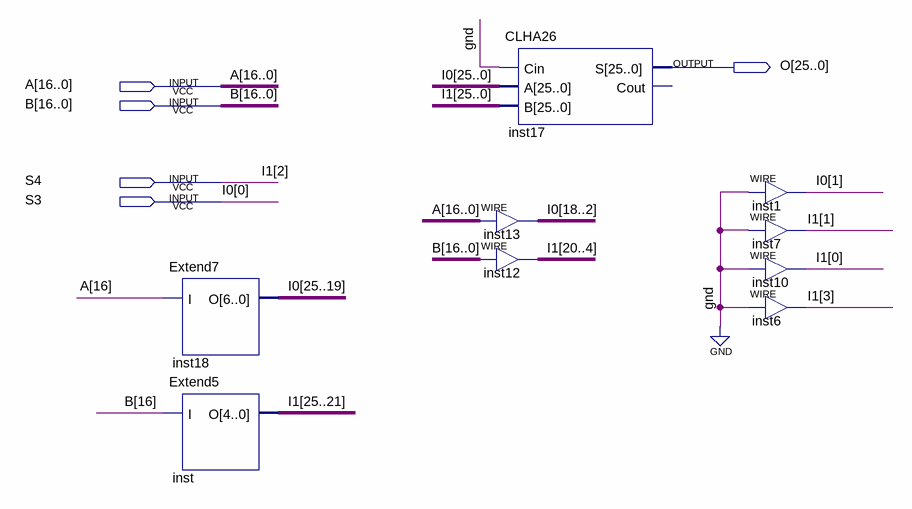
[diagram p0: schematic sheet]
// Quartus schematic R4R5.bdf as structural Verilog: 9 symbols, 5 pins
module R4R5 (
  input  [16:0] A,
  input  [16:0] B,
  input  S4,
  input  S3,
  output [25:0] O
);

  wire [25:0] I1;
  wire [25:1] I0;

  Extend7 inst18 (.I(A[16]), .O(I0[25:19]));
  Extend5 inst (.I(B[16]), .O(I1[25:21]));
  CLHA26 inst17 (.Cin(1'b0), .A({I0, S3}), .B({I1[25:3], S4, I1[1:0]}), .S(O));  // open: Cout
  assign I0[18:2] = A;  // WIRE inst13
  assign I1[20:4] = B;  // WIRE inst12
  assign I0[1] = 1'b0;  // WIRE inst1
  assign I1[1] = 1'b0;  // WIRE inst7
  assign I1[0] = 1'b0;  // WIRE inst10
  assign I1[3] = 1'b0;  // WIRE inst6

  // Other names for the same wires on the sheet: I0[0] = S3; I1[2] = S4
endmodule
